# Altium schematic sheet Power.SchDoc
size A4; SheetNumber: 1; SheetTotal: 5
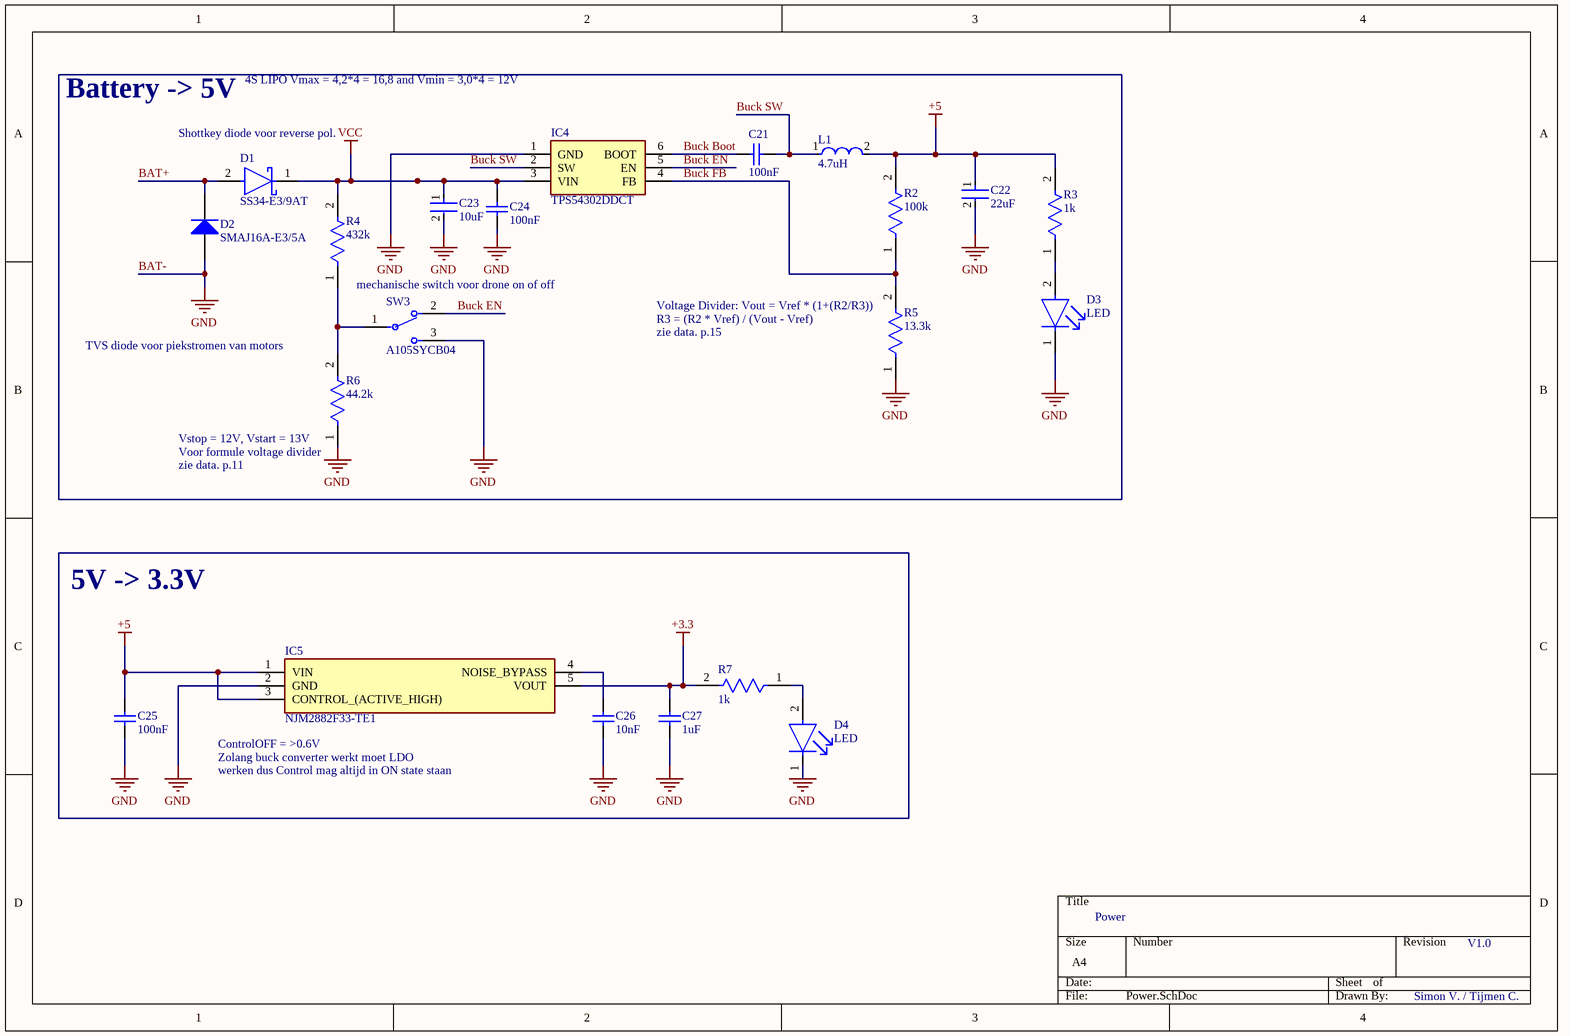
[diagram p0: Power.SchDoc]

## Parts
C21  100nF  [CAPC1608X92X38ML15T08]
C22  22uF  [FP-GRM188-0_2-IPC_A]
C23  10uF  [FP-ZRB18AR61E106ME01L-MFG]
C24  100nF  [CAPC1608X92X38ML15T08]
C25  100nF  [CAPC1608X92X38ML15T08]
C26  10nF  [CAPC1608X92X38LL15T08]
C27  1uF  [CAPC1608X90X35NL15T15]
D1  SS34-E3/9AT  [FP-SMC-MFG]
D2  SMAJ16A-E3/5A  [VISH-DO-214AC-2_M]
D3  LED  [FP-APHD1608LZGCK-MFG]
D4  LED  [FP-APHD1608LZGCK-MFG]
IC4  TPS54302DDCT  [SOT95P280X110-6N]
IC5  NJM2882F33-TE1  [SOT95P280X130-5N]
L1  4.7uH  [FP-IHLP-2020BZ-FP_1_905x2-MFG]
R2  100k  [FP-SR0603-MFG]
R3  1k  [FP-AC0603-IPC_B]
R4  432k  [FP-AC0603-MFG]
R5  13.3k  [FP-AF0603-IPC_A]
R6  44.2k  [FP-CRCW0603-HPe3-IPC_A]
R7  1k  [FP-AC0603-IPC_B]
SW3  A105SYCB04  [FP-A105SYCB04-MFG]

## Nets
+3.3: C27.2 IC5.5(VOUT) R7.2
+5: C22.1 C25.2 IC5.1(VIN) IC5.3(CONTROL_(ACTIVE_HIGH)) L1.2 R2.2 R3.2
BAT-: C22.2 C23.2 C24.1 C25.1 C26.1 C27.1 D2.2(A) D3.1(C) D4.1(C) IC4.1(GND) IC5.2(GND) R5.1 R6.1 SW3.3  [also labelled GND]
VCC: C23.1 C24.2 D1.1(C) IC4.3(VIN) R4.2
BAT+: D1.2(A) D2.1(K)
Buck Boot: C21.2 IC4.6(BOOT)
Buck EN: IC4.5(EN) SW3.2
Buck FB: IC4.4(FB) R2.1 R5.2
Buck SW: C21.1 IC4.2(SW) L1.1
NetC26_2: C26.2 IC5.4(NOISE_BYPASS)
NetD3_2: D3.2(A) R3.1
NetD4_2: D4.2(A) R7.1
NetR4_1: R4.1 R6.2 SW3.1

## Notes on the sheet
- Battery -> 5V
- 4S LIPO Vmax = 4,2*4 = 16,8 and Vmin = 3,0*4 = 12V
- (near D1) Shottkey diode voor reverse pol.
- mechanische switch voor drone on of off
- (near R5) Voltage Divider: Vout = Vref * (1+(R2/R3))
- (near R6) TVS diode voor piekstromen van motors
- zie data. p.15
- (near R5) R3 = (R2 * Vref) / (Vout - Vref)
- (near R6) Vstop = 12V, Vstart = 13V
- (near R6) Voor formule voltage divider
- zie data. p.11
- 5V -> 3.3V
- (near IC5) ControlOFF = >0.6V
- (near IC5) Zolang buck converter werkt moet LDO
- werken dus Control mag altijd in ON state staan
- Power
- V1.0
- Simon V. / Tijmen C.

## Library data of the parts
C21 C24 C25 = CMP-2006-01140-1: Part Number: VJ0603Y104MXXAC; Manufacturer: Vitramon
C22 = CMP-06035-063651-1: Multilayer Ceramic Capacitor 22uF 20% 16V X5R 0603 Paper T/R
C23 = CMP-06035-062385-2: CAP CER 10UF 25V X5R 0603; Tolerance: 20%; Min Operating Temperature: -55°C; Voltage: 25V; Case Code (Imperial): 0603; Case Code (Metric): 1608; Voltage Rating (DC): 25V; Max Operating Temperature: 85°C; Depth: 0.8mm; Thickness: 0.047inch; RoHS Compliant: Yes; Dielectric: X5R; Mount: Surface Mount; Voltage Rating: 25V; Length: 0.063inch; Height: 1mm; Packaging: Cut Tape; Capacitance: 10uF; REACH SVHC: No SVHC; Width: 0.031inch; Case/Package: 0603
C26 = CMP-2006-01201-1: Manufacturer: Vitramon; Part Number: VJ0603Y103JXXAC
C27 = CMP-2006-04534-1: Part Number: 0603YD105MAT2A; Manufacturer: AVX Interconnect / Elco
D1 = CMP-02539-000066-1: DIODE SCHOTTKY 40V 3A DO214AB; Peak Non-Repetitive Surge Current: 100A; Forward Voltage: 500mV; Element Configuration: Single; Max Reverse Current: 500uA; Case/Package: SMC; Radiation Hardening: No; Series: -; Max Surge Current: 100A; RoHS Compliant: Yes; Min Operating Temperature: -55°C; Average Rectified Current: 3A; Max Reverse Leakage Current: 500uA; Package Quantity: 3500; Max Reverse Voltage (DC): 40V; Forward Current: 3A; Packaging: Tape and Reel; Max Operating Temperature: 125°C; Max Repetitive Reverse Voltage (Vrrm): 40V; Number of Pins: 2; Mount: Surface Mount
D2 = CMP-0548-00305-2: Transient Voltage Suppressor, 6.40 to 231 V, 16 V Stand-off Voltage, Uni-Directional, -55 to 155 degC, 2-pin DO-214AC, Pb-Free, Tape and Reel; Manufacturer: Vishay Semiconductor; VWM (V): 16; ID (uA): 1; PPPM (W): 400, 300; VBR Uni-Directional (V): 6.4 to 231; IFSM: 40 A; PackageReference: DO-214AC-2; ComponentLink2Description: Datasheet; Operating Junction and Storage Temperature Range: -55 to 150 degC; PackageDescription: 2-Pin DO-214AC (SMA), Body 4.245 x 2.665 mm; Packing: Tape and Reel; DatasheetVersion: 12/8/2013; ComponentLink1URL: http://www.vishay.com/; Mounting Technology: Surface Mount; RoHS: TRUE; ComponentLink1Description: Manufacturer URL; ComponentLink2URL: http://www.vishay.com/docs/88390/smaj50a.pdf; ComponentLink3Description: Package Specification; PartNumber: SMAJ16A-E3/5A; ComponentLink3URL: http://www.vishay.com/docs/88390/smaj50a.pdf
D3 D4 = CMP-44529-000045-1: LED GREEN CLEAR 1608 SMD, type: APHD1608LZGCK; Test Current: 2mA; Dominant Wavelength: 525nm; Lens Color: Colorless; Luminous Intensity: 180mcd; Viewing Angle: 100°; Forward Voltage: 2.65V; Lens Size: 0.7mm; Lens Style: Round; Mount: Surface Mount; Packaging: Tape and Reel; Lens Transparency: Clear; Height: 0.75mm; Case/Package: 0603; Length: 1.6mm; Case Code (Metric): 1608; Width: 0.8mm; Color: Green; Case Code (Imperial): 0603
IC4 = TPS54302DDCT: Integrated Circuit; Manufacturer_Name: Texas Instruments; Datasheet Link: https://componentsearchengine.com/Datasheets/2/TPS54302DDCT.pdf; Height: 1.1mm; Manufacturer_Part_Number: TPS54302DDCT; Mouser Part Number: 595-TPS54302DDCT; Mouser Price/Stock: https://www.mouser.co.uk/ProductDetail/Texas-Instruments/TPS54302DDCT?qs=zEmsApcVOkXGTx6CMk2KtQ%3D%3D; Arrow Part Number: TPS54302DDCT; Arrow Price/Stock: https://www.arrow.com/en/products/tps54302ddct/texas-instruments?utm_currency=USD&region=nac
IC5 = NJM2882F33-TE1: Integrated Circuit; Manufacturer_Name: New Japan Radio; Datasheet Link: https://datasheet.datasheetarchive.com/originals/distributors/Datasheets_SAMA/4727f49f1a6595e3af9a467a77f12495.pdf; Height: 1.3mm; Manufacturer_Part_Number: NJM2882F33-TE1; Mouser Part Number: 513-NJM2882F33-TE1; Mouser Price/Stock: https://www.mouser.co.uk/ProductDetail/NJR/NJM2882F33-TE1?qs=A8FRqtAK7u9DuEIVjsUa8Q%3D%3D
L1 = CMP-02424-000137-1: Fixed Inductors Commercial High Saturation Series 4.7uH 2.8A 116.6mΩ 20%; Self Resonant Frequency: 28MHz; Test Frequency: 100kHz; Shielding: Shielded; Core Material: Metal; DC Resistance (DCR): 116.6mR; Max DC Current: 3A; Saturation Current: 5A; Radiation Hardening: No; Inductance: 4.7uH; Width: 0.204inch; Packaging: Tape and Reel; Height - Seated (Max): 0.079inch; Height: 2mm; Tolerance: 20%; RMS Current (Irms): 2.8A; Mount: Surface Mount; Military Standard: Not; Termination: SMD/SMT; Min Operating Temperature: -55°C; Max Operating Temperature: 125°C; Case/Package: 2020; Depth: 5.43mm; Package Quantity: 2000; Current Rating: 2.8A; Length: 5.49mm; Inductance Tolerance: 20%
R2 = CMP-03412-000894-1: RES SMD 0603 1/4W 1% 100K OHM; Manufacturer Part Number: SR0603FR-7T100KL; Manufacturer: Yageo; Tolerance: 0.01; Voltage Rating: 75V; Value: 100KΩ; Power Rating: 0.25W; Automotive Grade: Grade 0; Ipc Land Pattern Name: RESC16080X45; Digikey Description: RES SMD 0603 1/4W 1% 100K OHM; Device Class L3: Chip SMD Resistors; Octopart: https://octopart.com/sr0603fr-7t100kl-yageo-91478071; Lead Free: Yes; RoHS: TRUE; Series: SR; Device Class L1: Passive Components; ComponentLink2URL: http://www.yageo.com/documents/recent/PYu-SR_D_F%20tol_RoHS_L_3.pdf; ComponentLink2Description: Datasheet; Automotive: Yes; Category: Res; Temperature Range High: +155°C; Height: 0.55mm; Composition: Thick Film; Resistance: 100KΩ; Temperature Range Low: -55°C; Footprint Url: http://www.yageo.com/exep/pages/download/literatures/PYu-R_Mount_10.pdf; Device Class L2: Resistors; Temperature: -55°C to +155°C; Package: SR0603
R3 R7 = CMP-03412-047577-1: RES 1kΩ 1.00% 0.2W 0603
R4 = CMP-03412-010825-2: RES 432KΩ 1.00% 0.1W 0603; Resistance: 432kR; Temperature Coefficient: 100ppm/°C; Tolerance: 1%; Max Power Dissipation: 100mW; Voltage Rating: 50V; Case Code (Imperial): 0603; Max Operating Temperature: 155°C; Packaging: Tape and Reel; Case/Package: 0603; Min Operating Temperature: -55°C; Height: 0.022inch; Width: 0.8mm; Number of Terminations: 2; Resistor Type: Thick Film; Series: AC; Features: Moisture Resistant; Case Code (Metric): 1608; Length: 0.063inch; Power Rating: 100mW; RoHS Compliant: Yes; Termination: SMD/SMT
R5 = CMP-03412-046877-1: Anti-Sulfurated Chip Resistors Automotive Grade 13.3kΩ 1% 100ppm/°C 0603; Resistance: 13.3kR; Max Power Dissipation: 100mW; Resistor Type: Thick Film; Min Operating Temperature: -55°C; Number of Terminations: 2; Temperature Coefficient: 100ppm/°C; Height: 0.022inch; Case/Package: 0603; Max Operating Temperature: 155°C; Series: AF; Tolerance: 1%; Length: 0.063inch; RoHS Compliant: Yes; Packaging: Tape and Reel; Width: 0.031inch; Features: Moisture Resistant
R6 = CMP-02407-008692-1: RES Thick Film, 44.2kΩ, 1%, 0.33W, 100ppm/°C, 0603; Resistance: 44.2kR; Max Power Dissipation: 250mW; Length: 0.063inch; Contact Plating: Tin; Height: 0.022inch; Composition: Thick Film; Temperature Coefficient: 100ppm/°C; Termination: Wraparound; Mount: Surface Mount; Package Quantity: 5000; Lead Free: Lead Free; Case/Package: 0603; Width: 0.033inch; Packaging: Tape and Reel; Power Rating: 250mW; Max Operating Temperature: 155°C; Number of Terminations: 2; Features: Automotive AEC-Q200; Tolerance: 1%; Min Operating Temperature: -55°C
SW3 = CMP-03408-000016-1: SWITCH TOGGLE SPDT 0.4VA 20V; Power Rating: 400mW; Insulation Resistance: 30MR; Actuator Length: 10.41mm; Illumination Type: Illuminated; Contact Resistance: 10mR; Contact Current Rating: 400mA; Actuator Material: Phenolic; Contact Material: Copper; Termination: Solder; Throw Configuration: SPDT; Contact Plating: Gold; REACH SVHC: No SVHC; Series: Gemini A; Mount: Bushing; Package Quantity: 100; Voltage Rating (AC): 20V; Min Operating Temperature: -30°C; Max Voltage Rating (DC): 20V; Max Operating Temperature: 85°C; Flammability Rating: UL94 V-0; RoHS Compliant: Yes